# Altium project BEAGLEBONEBLACK.PrjPcb (part 1 of 6)
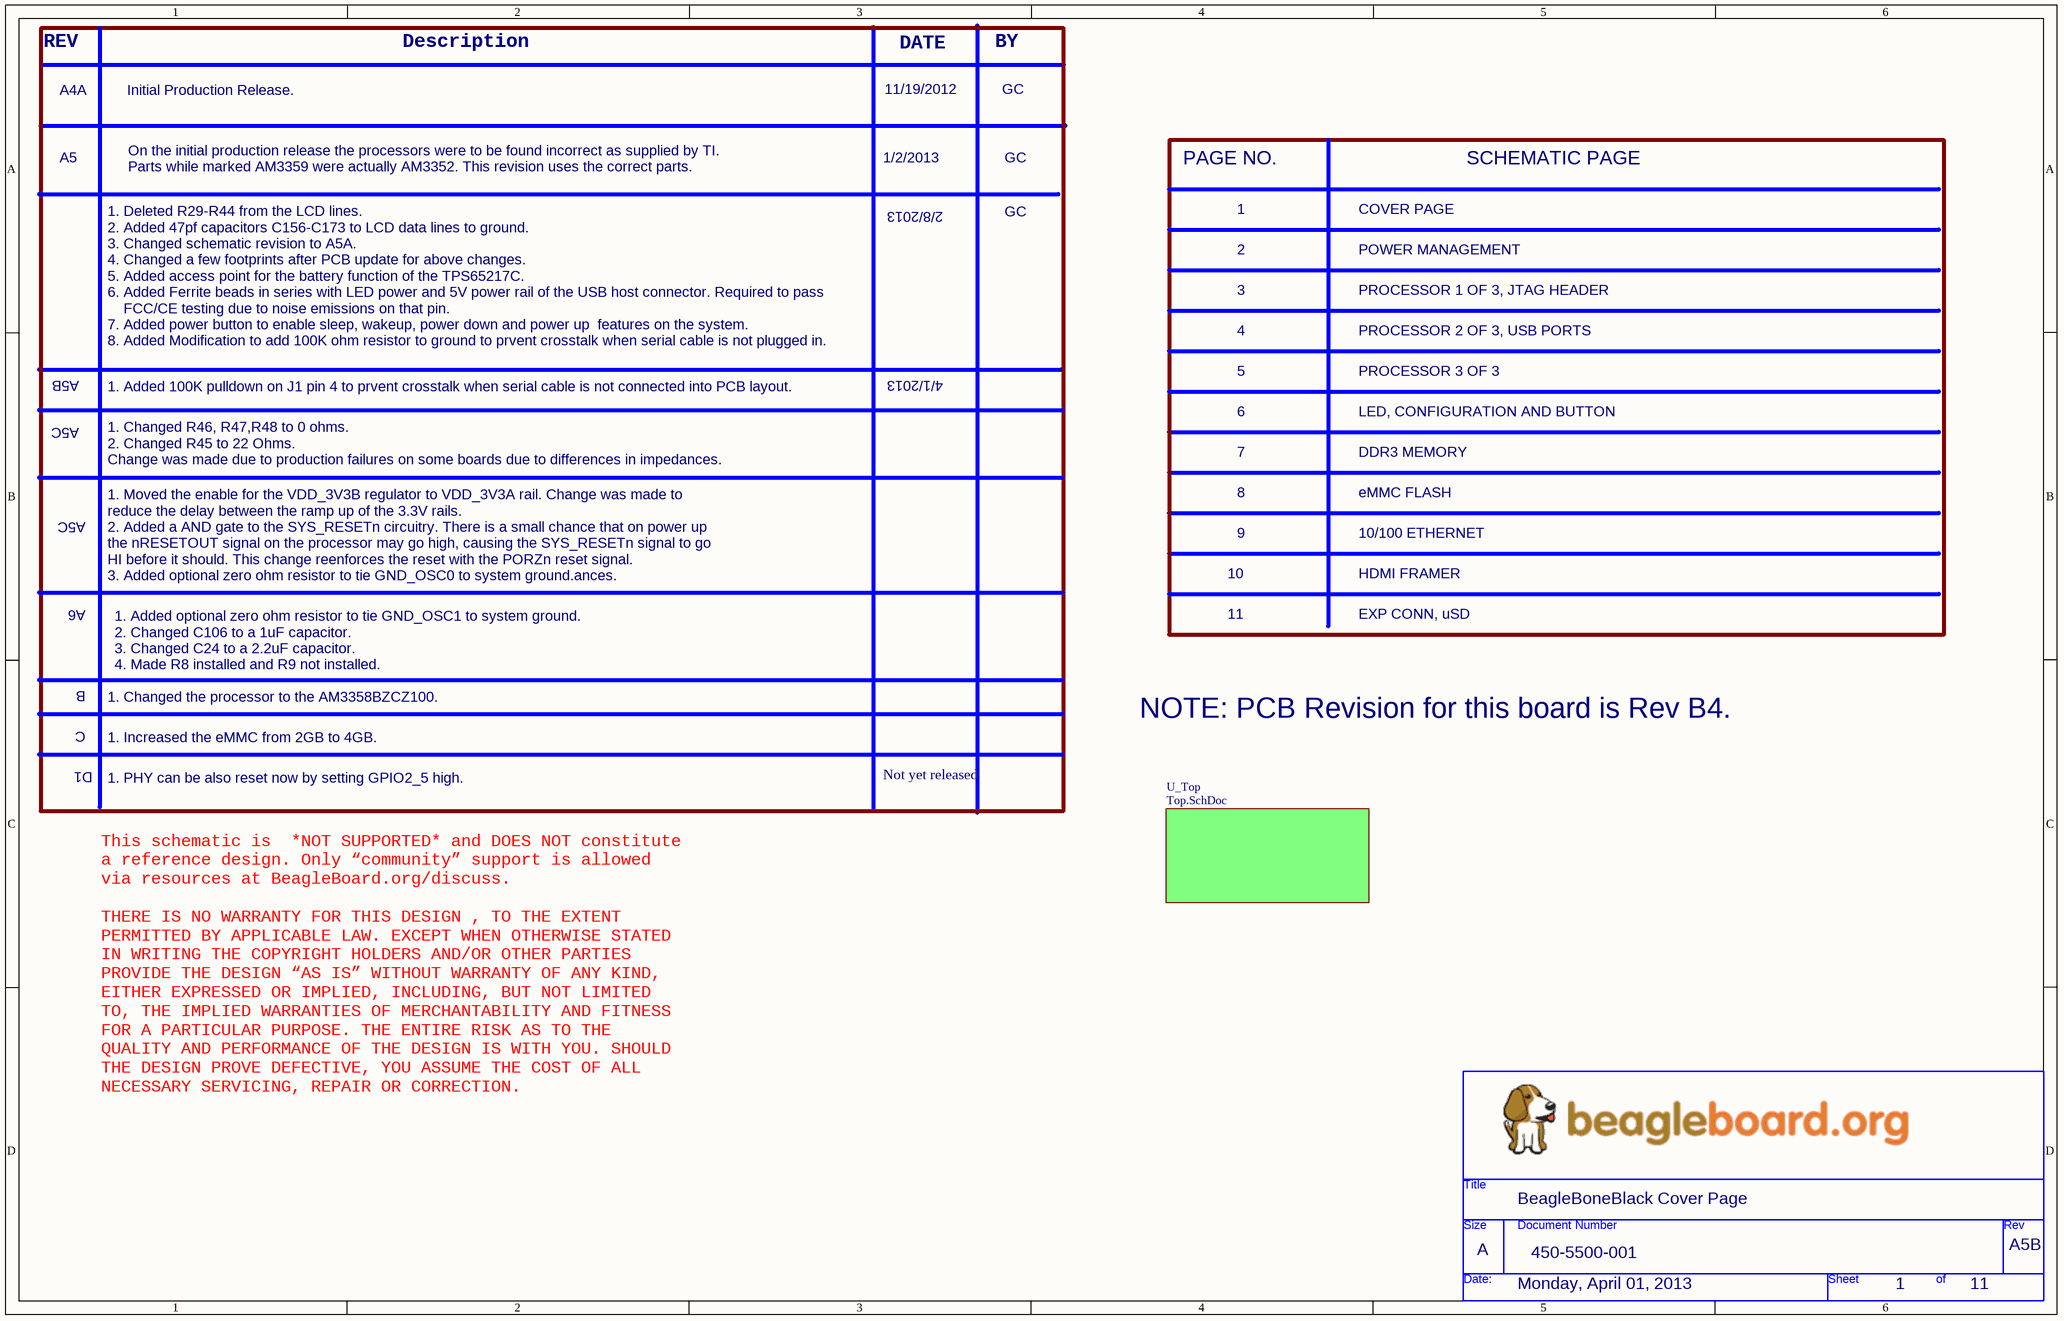
[diagram p0: P01_Title Page.SchDoc]
17 sheets, 400 parts. Net scope: flat (ports and power ports of the same name join across sheets).
Board file: BEAGLEBONE_BLACK.PCBDOC
Sheets:
  P01_Title Page.SchDoc
    U_Top = Top.SchDoc
      U_P02_Power Management = P02_Power Management.SchDoc
      U_P07_DDR3 Memory = P07_DDR3 Memory.SchDoc
      U_P10_HDMI Framer = P10_HDMI Framer.SchDoc
      U_P04_Processor 2 or 3, USB and Serial = P04_Processor 2 or 3, USB and Serial.SchDoc
      U_P03_Processor 1 of 3, JTAG Header = P03_Processor 1 of 3, JTAG Header.SchDoc
      U_P05_Processor Page 3 of 3 = P05_Processor Page 3 of 3.SchDoc
      U_P06_LED, Config, & Button = P06_LED, Config, & Button.SchDoc
      U_P08_eMMC = P08_eMMC.SchDoc
      U_P09_Ethernet = P09_Ethernet.SchDoc
      U_P11_Exp Conn, uSD, and = P11_Exp Conn, uSD, and .SchDoc
      Console.SchDoc = U_Console.SchDoc
      US_SDCARD = SDCARD.SchDoc
      U_BOARD_ID = BoardID.SchDoc
      U_USB_PC = USB_PC.SchDoc
      U_USB_HOST = USB_Host.SchDoc

## Sheet P01_Title Page.SchDoc
size 386 x 246 mm

### Parts
(Parts that share a designator on the sheet are numbered #1, #2 ... from top to bottom, then left to right.)
*#1  Page Create Date: Monday, April 01, 2013  Doc: 450-5500-001  RevCode: A5B  Title: BeagleBoneBlack Cover Page  Page Size: A  Page Number: 1  Page Count: 11  (hidden comment: BeagleBoard_org)  (graphical)

### Sub-sheets
U_Top = Top.SchDoc: no entries

### Notes on the sheet
- REV
- Description
- DATE
- BY
- A4A
- Initial Production Release.
- 11/19/2012
- GC
- A5
- On the initial production release the processors were to be found incorrect as supplied by TI.
  Parts while marked AM3359 were actually AM3352. This revision uses the correct parts.
- 1/2/2013
- PAGE NO.
- SCHEMATIC PAGE
- 2/8/2013
- 1
- 2
- POWER MANAGEMENT
- COVER PAGE
- 3
- PROCESSOR 1 OF 3, JTAG HEADER
- A5B
- 4/1/2013
- 4
- 5
- PROCESSOR 2 OF 3, USB PORTS
- PROCESSOR 3 OF 3
- A5C
- 1. Deleted R29-R44 from the LCD lines.
  2. Added 47pf capacitors C156-C173 to LCD data lines to ground.
  3. Changed schematic revision to A5A.
  4. Changed a few footprints after PCB update for above changes.
  5. Added access point for the battery function of the TPS65217C.
  6. Added Ferrite beads in series with LED power and 5V power rail of the USB host connector. Required to pass
  FCC/CE testing due to noise emissions on that pin.
  7. Added power button to enable sleep, wakeup, power down and power up  features on the system.
  8. Added Modification to add 100K ohm resistor to ground to prvent crosstalk when serial cable is not plugged in.
- 7
- 6
- DDR3 MEMORY
- LED, CONFIGURATION AND BUTTON
- 1. Added 100K pulldown on J1 pin 4 to prvent crosstalk when serial cable is not connected into PCB layout.
- 1. Changed R46, R47,R48 to 0 ohms.
  2. Changed R45 to 22 Ohms.
  Change was made due to production failures on some boards due to differences in impedances.
- 8
- eMMC FLASH
- 1. Moved the enable for the VDD_3V3B regulator to VDD_3V3A rail. Change was made to
  reduce the delay between the ramp up of the 3.3V rails.
  2. Added a AND gate to the SYS_RESETn circuitry. There is a small chance that on power up
  the nRESETOUT signal on the processor may go high, causing the SYS_RESETn signal to go
  HI before it should. This change reenforces the reset with the PORZn reset signal.
  3. Added optional zero ohm resistor to tie GND_OSC0 to system ground.ances.
- 10
- 9
- HDMI FRAMER
- 10/100 ETHERNET
- A6
- 11
- EXP CONN, uSD
- B
- C
- 1. Changed the processor to the AM3358BZCZ100.
- 1. Added optional zero ohm resistor to tie GND_OSC1 to system ground.
  2. Changed C106 to a 1uF capacitor.
  3. Changed C24 to a 2.2uF capacitor.
  4. Made R8 installed and R9 not installed.
- NOTE: PCB Revision for this board is Rev B4.
- D1
- 1. Increased the eMMC from 2GB to 4GB.
- 1. PHY can be also reset now by setting GPIO2_5 high.
- Not yet released
- This schematic is  *NOT SUPPORTED* and DOES NOT constitute
  a reference design. Only “community” support is allowed
  via resources at BeagleBoard.org/discuss.
  THERE IS NO WARRANTY FOR THIS DESIGN , TO THE EXTENT
  PERMITTED BY APPLICABLE LAW. EXCEPT WHEN OTHERWISE STATED
  IN WRITING THE COPYRIGHT HOLDERS AND/OR OTHER PARTIES
  PROVIDE THE DESIGN “AS IS” WITHOUT WARRANTY OF ANY KIND,
  EITHER EXPRESSED OR IMPLIED, INCLUDING, BUT NOT LIMITED
  TO, THE IMPLIED WARRANTIES OF MERCHANTABILITY AND FITNESS
  FOR A PARTICULAR PURPOSE. THE ENTIRE RISK AS TO THE
  QUALITY AND PERFORMANCE OF THE DESIGN IS WITH YOU. SHOULD
  THE DESIGN PROVE DEFECTIVE, YOU ASSUME THE COST OF ALL
  NECESSARY SERVICING, REPAIR OR CORRECTION.
- (in symbol BeagleBoard_org) Title; Size; Document Number; Rev; Date:; Sheet; of

## Sheet Top.SchDoc
size Tabloid
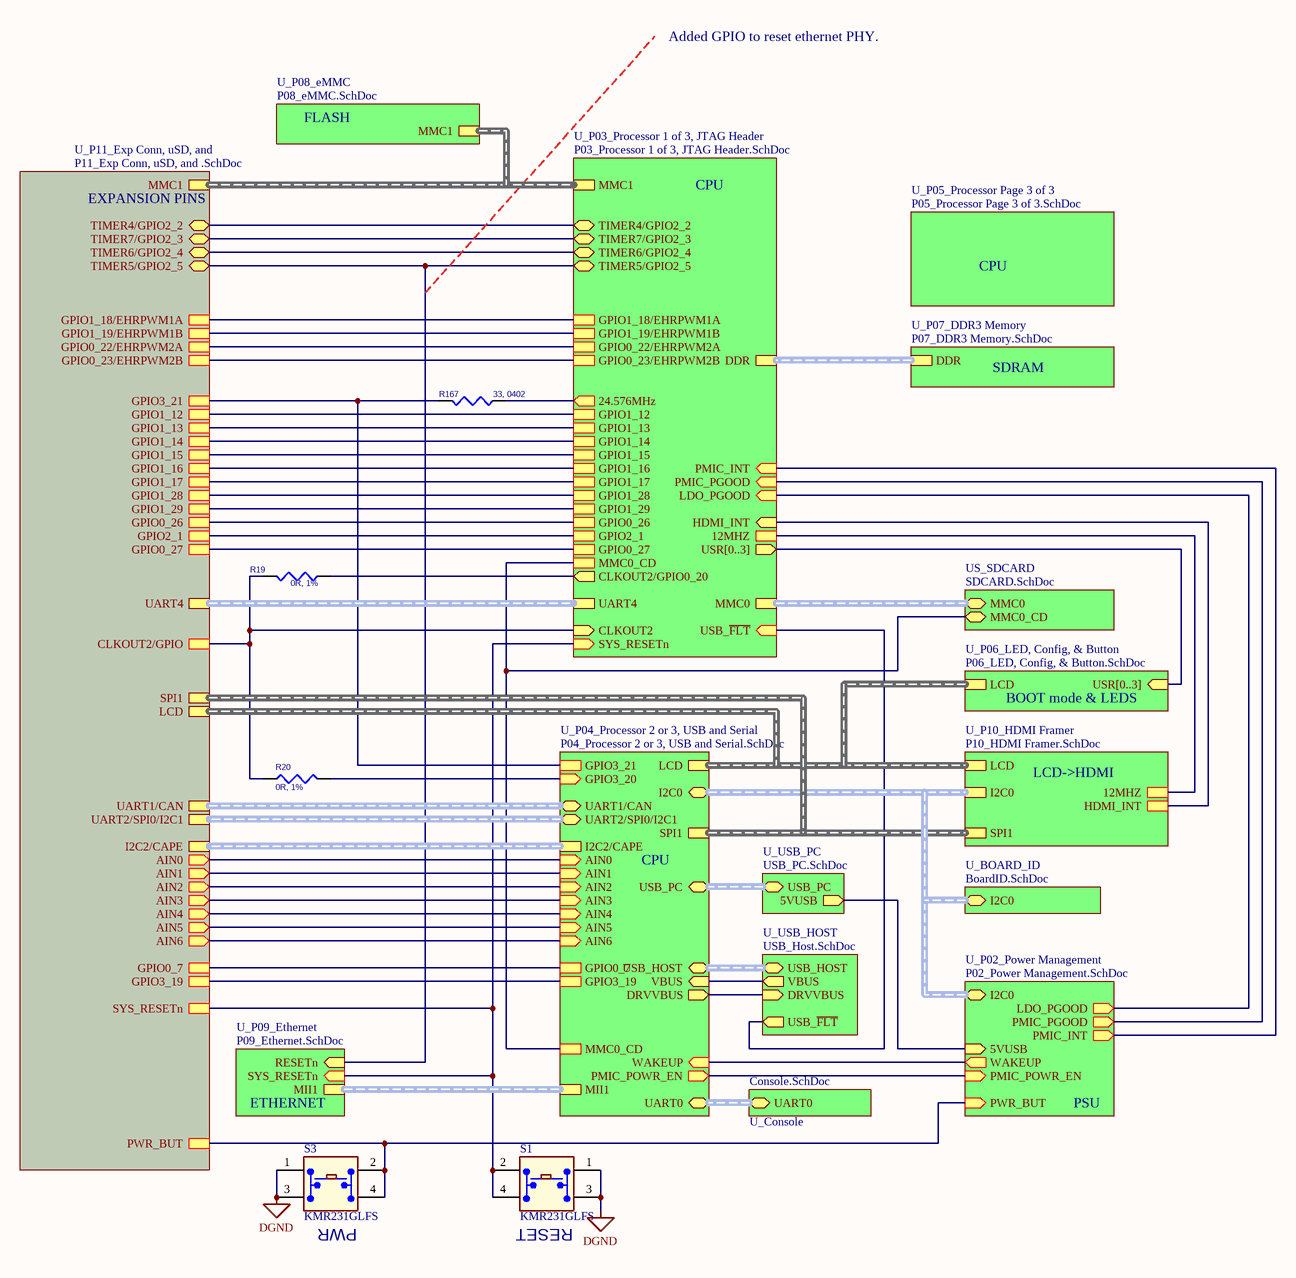
[diagram p1: Top.SchDoc]

### Parts
R19  0R, 1%  [402]
R20  0R, 1%  [402]
R167  33, 0402  [402]
S1  KMR231GLFS  [SW4SMD_63X161LS]
S3  KMR231GLFS  [SW4SMD_63X161LS]

### Sub-sheets
Console.SchDoc = U_Console: UART0 (harness UART)
U_BOARD_ID = BoardID.SchDoc: I2C0 (harness I2C)
U_P02_Power Management = P02_Power Management.SchDoc: PMIC_PGOOD (out), LDO_PGOOD (out), WAKEUP (out), PMIC_INT (out), PMIC_POWR_EN (in), PWR_BUT (in), I2C0 (harness I2C), 5VUSB (in)
U_P03_Processor 1 of 3, JTAG Header = P03_Processor 1 of 3, JTAG Header.SchDoc: GPIO2_1, GPIO1_29, GPIO1_28, GPIO0_22/EHRPWM2A, GPIO0_23/EHRPWM2B, GPIO0_26, GPIO0_27, GPIO1_12, GPIO1_13, GPIO1_14, GPIO1_15, GPIO1_17, GPIO1_18/EHRPWM1A, GPIO1_19/EHRPWM1B, USB_~{FLT} (in), SYS_RESETn (in), PMIC_INT (in), 12MHZ, GPIO1_16, 24.576MHz (out), LDO_PGOOD (in), PMIC_PGOOD (in), MMC0_CD, HDMI_INT (in), USR[0..3] (out), MMC1 (harness MMC1), MMC0 (harness MMC0), UART4 (harness UART), DDR (harness DDR), CLKOUT2/GPIO0_20 (out), CLKOUT2 (in), TIMER5/GPIO2_5 (bidir), TIMER4/GPIO2_2 (bidir), TIMER7/GPIO2_3 (bidir), TIMER6/GPIO2_4 (bidir)
U_P04_Processor 2 or 3, USB and Serial = P04_Processor 2 or 3, USB and Serial.SchDoc: GPIO3_21, GPIO3_19, GPIO3_20 (in), PMIC_POWR_EN (out), WAKEUP (in), AIN0 (in), AIN1 (in), AIN2 (in), AIN3 (in), AIN4 (in), AIN5 (in), AIN6 (in), MMC0_CD, GPIO0_7, LCD (harness LCD), SPI1 (harness SPI), I2C2/CAPE (harness I2C), MII1 (harness MII), I2C0 (harness I2C), UART0 (harness UART), UART1/CAN (harness UART/CAN), UART2/SPI0/I2C1 (harness UART/SPI/I2C1), USB_PC (harness USB_PC), USB_HOST (harness USB_PC), VBUS (in), DRVVBUS (out)
U_P05_Processor Page 3 of 3 = P05_Processor Page 3 of 3.SchDoc: no entries
U_P06_LED, Config, & Button = P06_LED, Config, & Button.SchDoc: USR[0..3] (in), LCD (harness LCD)
U_P07_DDR3 Memory = P07_DDR3 Memory.SchDoc: DDR (harness DDR)
U_P08_eMMC = P08_eMMC.SchDoc: MMC1 (harness MMC1)
U_P09_Ethernet = P09_Ethernet.SchDoc: MII1 (harness MII), RESETn (in), SYS_RESETn (in)
U_P10_HDMI Framer = P10_HDMI Framer.SchDoc: HDMI_INT, 12MHZ, I2C0 (harness I2C), LCD (harness LCD), SPI1 (harness SPI)
U_P11_Exp Conn, uSD, and = P11_Exp Conn, uSD, and .SchDoc: GPIO1_13, GPIO0_23/EHRPWM2B, GPIO1_15, GPIO0_27, GPIO0_22/EHRPWM2A, GPIO1_12, GPIO0_26, GPIO1_14, GPIO2_1, GPIO1_29, PWR_BUT, GPIO1_16, GPIO1_17, GPIO3_21, GPIO3_19, AIN4 (out), AIN6 (out), AIN2 (out), AIN0 (out), CLKOUT2/GPIO, SYS_RESETn, GPIO1_28, GPIO1_18/EHRPWM1A, GPIO1_19/EHRPWM1B, AIN5 (out), AIN3 (out), AIN1 (out), GPIO0_7, LCD (harness LCD), MMC1 (harness MMC1), UART4 (harness UART), I2C2/CAPE (harness I2C), UART2/SPI0/I2C1 (harness UART/SPI/I2C1), UART1/CAN (harness UART/CAN), SPI1 (harness SPI), TIMER5/GPIO2_5 (bidir), TIMER7/GPIO2_3 (bidir), TIMER6/GPIO2_4 (bidir), TIMER4/GPIO2_2 (bidir)
U_USB_HOST = USB_Host.SchDoc: USB_HOST (harness USB_PC), USB_~{FLT} (out), VBUS (out), DRVVBUS (in)
U_USB_PC = USB_PC.SchDoc: USB_PC (harness USB_PC), 5VUSB (out)
US_SDCARD = SDCARD.SchDoc: MMC0 (harness MMC0), MMC0_CD

### Nets
DGND: S1.1(A1) S1.3(A3) S3.1(A1) S3.3(A3)
NetR19_1: R19.1 ; sheet U_P03_Processor 1 of 3, JTAG Header/CLKOUT2/GPIO0_20
NetR19_2: R19.2 R20.1 ; sheet U_P03_Processor 1 of 3, JTAG Header/CLKOUT2, sheet U_P11_Exp Conn, uSD, and/CLKOUT2/GPIO
NetR20_2: R20.2 ; sheet U_P04_Processor 2 or 3, USB and Serial/GPIO3_20
NetR167_1: R167.1 ; sheet U_P03_Processor 1 of 3, JTAG Header/24.576MHz
NetR167_2: R167.2 ; sheet U_P04_Processor 2 or 3, USB and Serial/GPIO3_21, sheet U_P11_Exp Conn, uSD, and/GPIO3_21
NetS1_2: S1.2(A2) S1.4 ; sheet U_P03_Processor 1 of 3, JTAG Header/SYS_RESETn, sheet U_P09_Ethernet/SYS_RESETn, sheet U_P11_Exp Conn, uSD, and/SYS_RESETn
NetS3_2: S3.2(A2) S3.4 ; sheet U_P02_Power Management/PWR_BUT, sheet U_P11_Exp Conn, uSD, and/PWR_BUT
(unnamed): sheet U_P02_Power Management/PMIC_PGOOD, sheet U_P03_Processor 1 of 3, JTAG Header/PMIC_PGOOD
(unnamed): sheet U_P02_Power Management/LDO_PGOOD, sheet U_P03_Processor 1 of 3, JTAG Header/LDO_PGOOD
(unnamed): sheet U_P02_Power Management/WAKEUP, sheet U_P04_Processor 2 or 3, USB and Serial/WAKEUP
(unnamed): sheet U_P02_Power Management/PMIC_INT, sheet U_P03_Processor 1 of 3, JTAG Header/PMIC_INT
(unnamed): sheet U_P02_Power Management/PMIC_POWR_EN, sheet U_P04_Processor 2 or 3, USB and Serial/PMIC_POWR_EN
(unnamed): sheet U_P02_Power Management/5VUSB, sheet U_USB_PC/5VUSB
(unnamed): sheet U_P10_HDMI Framer/HDMI_INT, sheet U_P03_Processor 1 of 3, JTAG Header/HDMI_INT
(unnamed): sheet U_P10_HDMI Framer/12MHZ, sheet U_P03_Processor 1 of 3, JTAG Header/12MHZ
(unnamed): sheet U_P04_Processor 2 or 3, USB and Serial/GPIO3_19, sheet U_P11_Exp Conn, uSD, and/GPIO3_19
(unnamed): sheet U_P04_Processor 2 or 3, USB and Serial/AIN0, sheet U_P11_Exp Conn, uSD, and/AIN0
(unnamed): sheet U_P04_Processor 2 or 3, USB and Serial/AIN1, sheet U_P11_Exp Conn, uSD, and/AIN1
(unnamed): sheet U_P04_Processor 2 or 3, USB and Serial/AIN2, sheet U_P11_Exp Conn, uSD, and/AIN2
(unnamed): sheet U_P04_Processor 2 or 3, USB and Serial/AIN3, sheet U_P11_Exp Conn, uSD, and/AIN3
(unnamed): sheet U_P04_Processor 2 or 3, USB and Serial/AIN4, sheet U_P11_Exp Conn, uSD, and/AIN4
(unnamed): sheet U_P04_Processor 2 or 3, USB and Serial/AIN5, sheet U_P11_Exp Conn, uSD, and/AIN5
(unnamed): sheet U_P04_Processor 2 or 3, USB and Serial/AIN6, sheet U_P11_Exp Conn, uSD, and/AIN6
(unnamed): sheet U_P04_Processor 2 or 3, USB and Serial/MMC0_CD, sheet U_P03_Processor 1 of 3, JTAG Header/MMC0_CD, sheet US_SDCARD/MMC0_CD
(unnamed): sheet U_P04_Processor 2 or 3, USB and Serial/GPIO0_7, sheet U_P11_Exp Conn, uSD, and/GPIO0_7
(unnamed): sheet U_P04_Processor 2 or 3, USB and Serial/VBUS, sheet U_USB_HOST/VBUS
(unnamed): sheet U_P04_Processor 2 or 3, USB and Serial/DRVVBUS, sheet U_USB_HOST/DRVVBUS
(unnamed): sheet U_P03_Processor 1 of 3, JTAG Header/GPIO2_1, sheet U_P11_Exp Conn, uSD, and/GPIO2_1
(unnamed): sheet U_P03_Processor 1 of 3, JTAG Header/GPIO1_29, sheet U_P11_Exp Conn, uSD, and/GPIO1_29
(unnamed): sheet U_P03_Processor 1 of 3, JTAG Header/GPIO1_28, sheet U_P11_Exp Conn, uSD, and/GPIO1_28
(unnamed): sheet U_P03_Processor 1 of 3, JTAG Header/GPIO0_22/EHRPWM2A, sheet U_P11_Exp Conn, uSD, and/GPIO0_22/EHRPWM2A
(unnamed): sheet U_P03_Processor 1 of 3, JTAG Header/GPIO0_23/EHRPWM2B, sheet U_P11_Exp Conn, uSD, and/GPIO0_23/EHRPWM2B
(unnamed): sheet U_P03_Processor 1 of 3, JTAG Header/GPIO0_26, sheet U_P11_Exp Conn, uSD, and/GPIO0_26
(unnamed): sheet U_P03_Processor 1 of 3, JTAG Header/GPIO0_27, sheet U_P11_Exp Conn, uSD, and/GPIO0_27
(unnamed): sheet U_P03_Processor 1 of 3, JTAG Header/GPIO1_12, sheet U_P11_Exp Conn, uSD, and/GPIO1_12
(unnamed): sheet U_P03_Processor 1 of 3, JTAG Header/GPIO1_13, sheet U_P11_Exp Conn, uSD, and/GPIO1_13
(unnamed): sheet U_P03_Processor 1 of 3, JTAG Header/GPIO1_14, sheet U_P11_Exp Conn, uSD, and/GPIO1_14
(unnamed): sheet U_P03_Processor 1 of 3, JTAG Header/GPIO1_15, sheet U_P11_Exp Conn, uSD, and/GPIO1_15
(unnamed): sheet U_P03_Processor 1 of 3, JTAG Header/GPIO1_17, sheet U_P11_Exp Conn, uSD, and/GPIO1_17
(unnamed): sheet U_P03_Processor 1 of 3, JTAG Header/GPIO1_18/EHRPWM1A, sheet U_P11_Exp Conn, uSD, and/GPIO1_18/EHRPWM1A
(unnamed): sheet U_P03_Processor 1 of 3, JTAG Header/GPIO1_19/EHRPWM1B, sheet U_P11_Exp Conn, uSD, and/GPIO1_19/EHRPWM1B
(unnamed): sheet U_P03_Processor 1 of 3, JTAG Header/USB_~{FLT}, sheet U_USB_HOST/USB_~{FLT}
(unnamed): sheet U_P03_Processor 1 of 3, JTAG Header/GPIO1_16, sheet U_P11_Exp Conn, uSD, and/GPIO1_16
(unnamed): sheet U_P03_Processor 1 of 3, JTAG Header/TIMER5/GPIO2_5, sheet U_P09_Ethernet/RESETn, sheet U_P11_Exp Conn, uSD, and/TIMER5/GPIO2_5
(unnamed): sheet U_P03_Processor 1 of 3, JTAG Header/TIMER4/GPIO2_2, sheet U_P11_Exp Conn, uSD, and/TIMER4/GPIO2_2
(unnamed): sheet U_P03_Processor 1 of 3, JTAG Header/TIMER7/GPIO2_3, sheet U_P11_Exp Conn, uSD, and/TIMER7/GPIO2_3
(unnamed): sheet U_P03_Processor 1 of 3, JTAG Header/TIMER6/GPIO2_4, sheet U_P11_Exp Conn, uSD, and/TIMER6/GPIO2_4

### Buses and harness runs
bus sheet U_P03_Processor 1 of 3, JTAG Header/USR[0..3] = sheet U_P06_LED, Config, & Button/USR[0..3]
harness sheet Console.SchDoc/UART0 = sheet U_P04_Processor 2 or 3, USB and Serial/UART0
harness sheet U_BOARD_ID/I2C0 = sheet U_P02_Power Management/I2C0 = sheet U_P04_Processor 2 or 3, USB and Serial/I2C0 = sheet U_P10_HDMI Framer/I2C0
harness sheet U_P03_Processor 1 of 3, JTAG Header/DDR = sheet U_P07_DDR3 Memory/DDR
harness sheet U_P03_Processor 1 of 3, JTAG Header/MMC0 = sheet US_SDCARD/MMC0
harness sheet U_P03_Processor 1 of 3, JTAG Header/MMC1 = sheet U_P08_eMMC/MMC1 = sheet U_P11_Exp Conn, uSD, and/MMC1
harness sheet U_P03_Processor 1 of 3, JTAG Header/UART4 = sheet U_P11_Exp Conn, uSD, and/UART4
harness sheet U_P04_Processor 2 or 3, USB and Serial/I2C2/CAPE = sheet U_P11_Exp Conn, uSD, and/I2C2/CAPE
harness sheet U_P04_Processor 2 or 3, USB and Serial/LCD = sheet U_P06_LED, Config, & Button/LCD = sheet U_P10_HDMI Framer/LCD = sheet U_P11_Exp Conn, uSD, and/LCD
harness sheet U_P04_Processor 2 or 3, USB and Serial/MII1 = sheet U_P09_Ethernet/MII1
harness sheet U_P04_Processor 2 or 3, USB and Serial/SPI1 = sheet U_P10_HDMI Framer/SPI1 = sheet U_P11_Exp Conn, uSD, and/SPI1
harness sheet U_P04_Processor 2 or 3, USB and Serial/UART1/CAN = sheet U_P11_Exp Conn, uSD, and/UART1/CAN
harness sheet U_P04_Processor 2 or 3, USB and Serial/UART2/SPI0/I2C1 = sheet U_P11_Exp Conn, uSD, and/UART2/SPI0/I2C1
harness sheet U_P04_Processor 2 or 3, USB and Serial/USB_HOST = sheet U_USB_HOST/USB_HOST
harness sheet U_P04_Processor 2 or 3, USB and Serial/USB_PC = sheet U_USB_PC/USB_PC

### Notes on the sheet
- Added GPIO to reset ethernet PHY.
- FLASH
- EXPANSION PINS
- CPU
- SDRAM
- BOOT mode & LEDS
- LCD->HDMI
- ETHERNET
- PSU
- (near S3) PWR
- (near S1) RESET

### Library data of the parts
R19 R20 = RES_0_1/16W_1%_0402: RES 0.0 OHM 1/16W 0402 SMD; Manufacturer: Yageo; Manufacturer Part Number: RC0402JR-070RL; Resistance (Ohms): 0.0; Power (Watts): 0.063W, 1/16W; Tolerance: Jumper; Supplier 1: Digi-Key; Supplier Part Number 1: 311-0.0JRDKR-ND; RoHS: RoHS Compliant; Category: Resistors; Stock 1: 4904429; Pricing 1: 1=0.1, 10=0.012, 25=0.0092, 100=0.0055, 250=0.00476, 500=0.00336, 1000=0.00237, 2500=0.00206, 5000=0.00178 (USD); Composition: Thick Film; Features: -; Temperature Coefficient: -; Package / Case: 0402 (1005 Metric); Supplier Device Package: 0402; Size / Dimension: 0.039" L x 0.020" W (1.00mm x 0.50mm); Height: 0.016" (0.40mm); Number of Terminations: 2; Packaging: Digi-Reel®; ComponentLink1URL: http://www.yageo.com/documents/recent/PYu-RC0402_51_RoHS_L_6.pdf; ComponentLink1Description: http://www.yageo.com/documents/recent/PYu-RC0402_51_RoHS_L_6.pdf
R167 = RES_33_0402: RES 33 OHM 1/16W 5% 0402 SMD; Manufacturer: Panasonic Electronic Components; Manufacturer Part Number: ERJ-2GEJ330X; Resistance (Ohms): 33; Power (Watts): 0.1W, 1/10W; Temperature Coefficient: ±200ppm/°C; Supplier 1: Digi-Key; Supplier Part Number 1: P33JDKR-ND; RoHS: RoHS Compliant; Category: Resistors; Stock 1: 5879945; Pricing 1: 1=0.1, 50=0.0172, 100=0.0131, 250=0.00976, 500=0.0072, 1000=0.0048, 5000=0.00338 (USD); Composition: Thick Film; Features: -; Tolerance: ±5%; Package / Case: 0402 (1005 Metric); Supplier Device Package: 0402; Size / Dimension: 0.039" L x 0.020" W (1.00mm x 0.50mm); Height: 0.016" (0.40mm); Number of Terminations: 2; Packaging: Digi-Reel®; ComponentLink1URL: http://industrial.panasonic.com/www-cgi/jvcr13pz.cgi?E+PZ+3+AOA0001+ERJ2GEJ330X+7+WW; ComponentLink1Description: http://industrial.panasonic.com/www-cgi/jvcr13pz.cgi?E+PZ+3+AOA0001+ERJ2GEJ330X+7+WW
S1 S3 = KMR2: Microminiature Tact Switch for SMT; Manufacturer: C&K Components; Circuit: SPST-NO; Switch Function: Off-Mom; Contact Rating @ Voltage: 0.05A @ 32VDC; Actuator Type: Standard; Actuator Height off PCB, from Pins: 1.90mm; Actuator Orientation: Top Actuated; Outline: 4.60mm x 2.80mm; Illumination: Non-Illuminated; Operating Force: 300gf; Switch Travel: 0.25mm; Mechanical Life: 150,000 Cycles; Supplier 1: Digi-Key; Supplier Part Number 1: 401-1429-6-ND; Manufacturer Part Number: KMR231GLFS; RoHS: RoHS Compliant; Category: Switches; Stock 1: 32289; Pricing 1: 1=0.44, 10=0.416, 25=0.3744, 50=0.3326, 100=0.3188, 250=0.29108, 500=0.2772, 1000=0.22869 (USD); Mounting Type: Surface Mount; Termination Style: Gull Wing; Illumination Voltage (Nominal): -; Illumination Type, Color: -; Ingress Protection: -; Features: Grounding Pin; Packaging: Digi-Reel®; Actuator Material: -; Operating Temperature: -40°C ~ 85°C; ComponentLink1URL: http://www.ck-components.com/index.php?module=media&action=Display&cmpref=14414&lang=en&width=&height=&format=&alt=; ComponentLink1Description: http://www.ck-components.com/index.php?module=media&action=Display&cmpref=14414&lang=en&width=&height=&format=&alt=

## Sheet P02_Power Management.SchDoc
size 386 x 246 mm
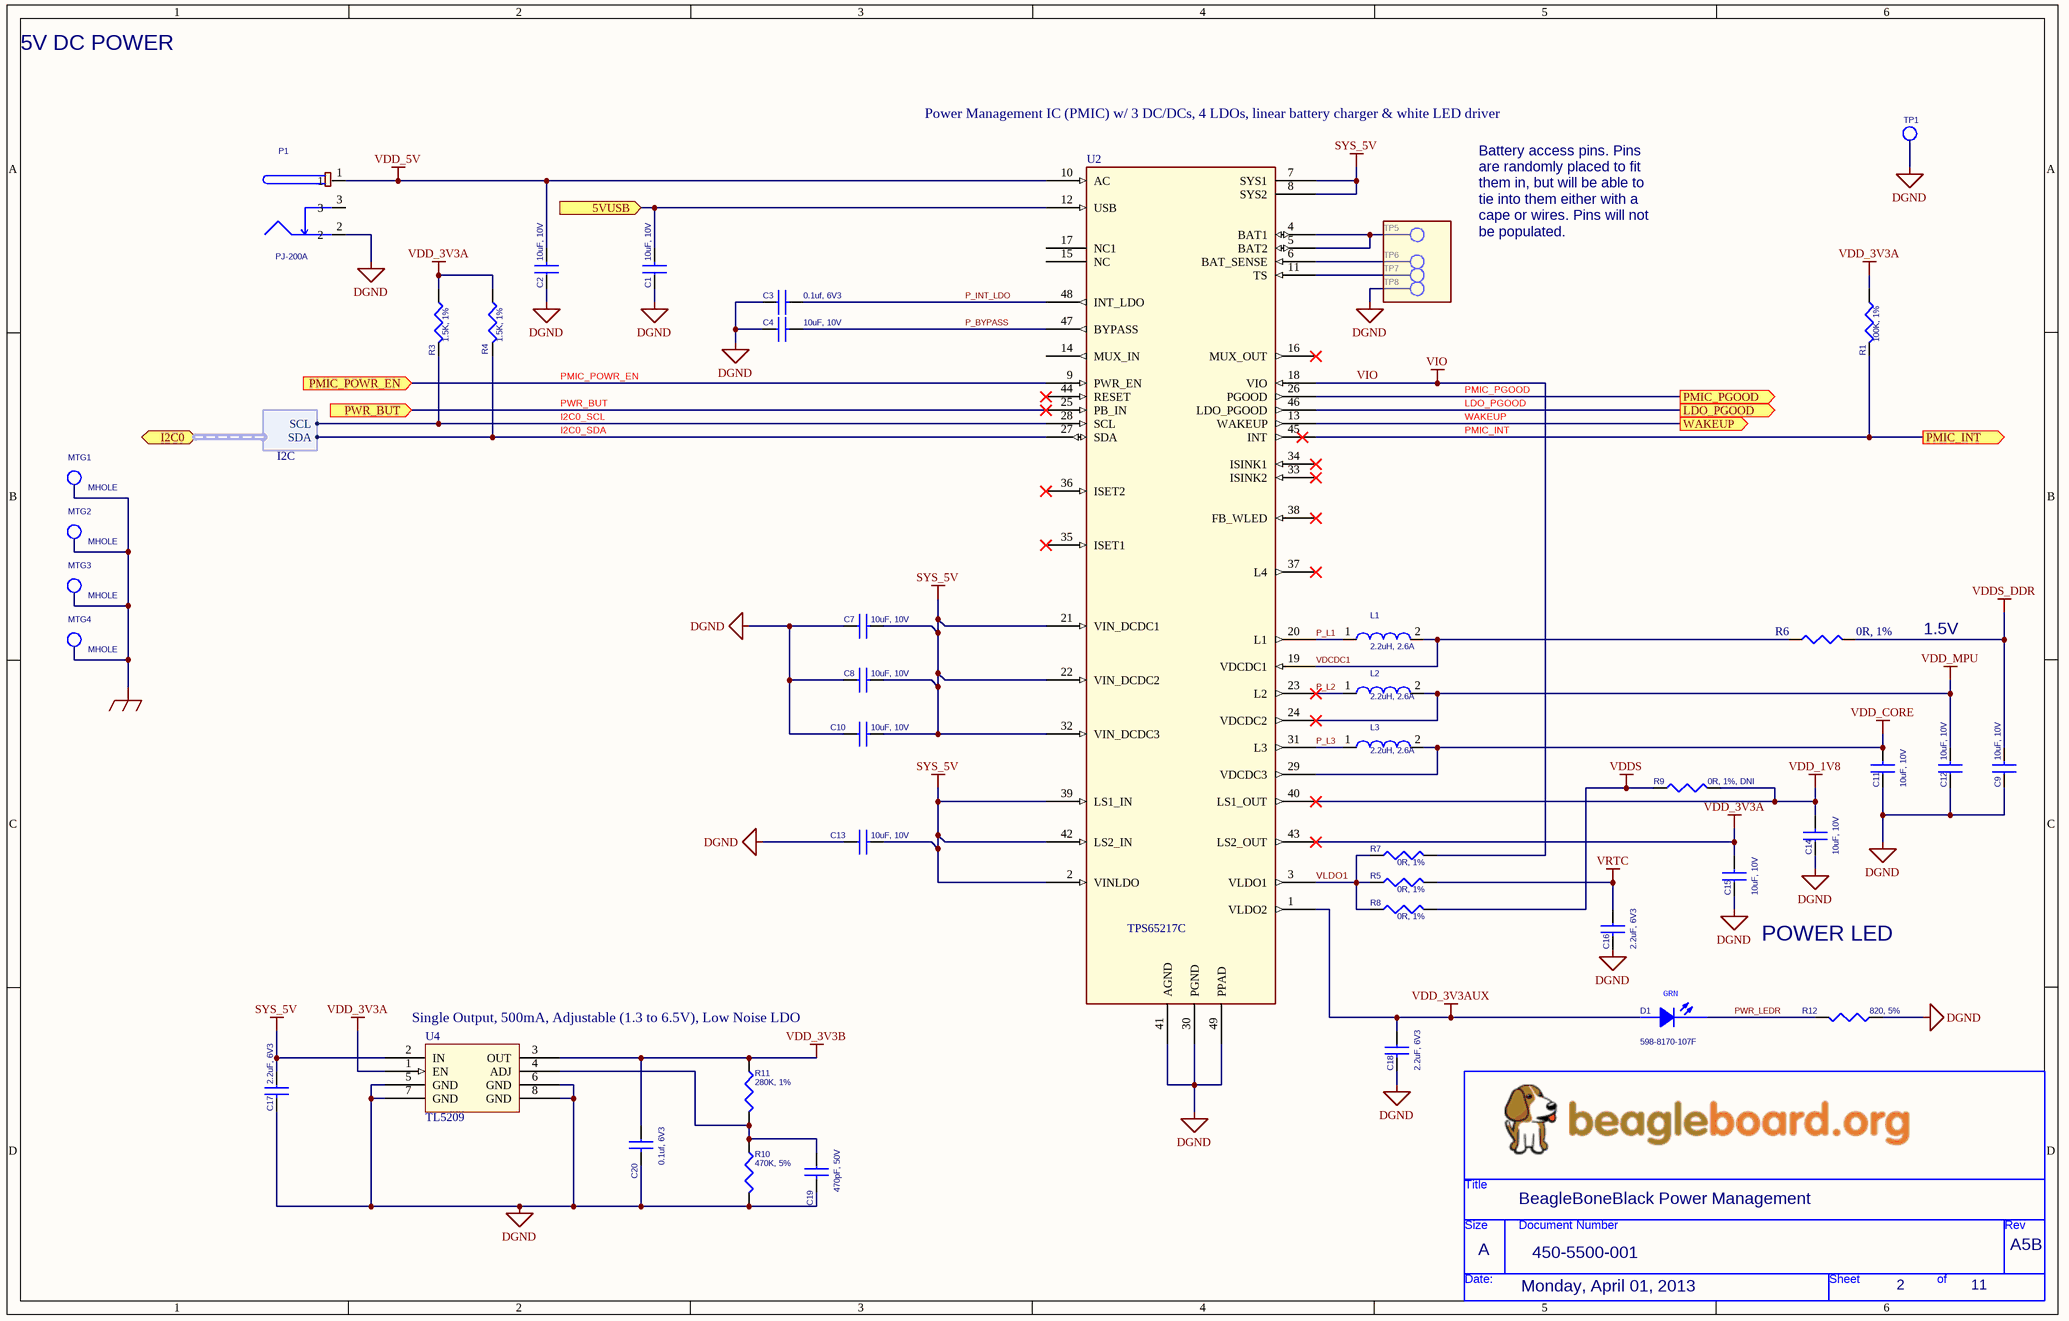
[diagram p2: P02_Power Management.SchDoc]

### Parts
(Parts that share a designator on the sheet are numbered #1, #2 ... from top to bottom, then left to right.)
*#2  Page Create Date: Monday, April 01, 2013  Doc: 450-5500-001  RevCode: A5B  Title: BeagleBoneBlack Power Management  Page Size: A  Page Number: 2  Page Count: 11  (hidden comment: BeagleBoard_org)  (graphical)
C1  10uF, 10V  [805]
C2  10uF, 10V  [805]
C3  0.1uf, 6V3  [402]
C4  10uF, 10V  [805]
C7  10uF, 10V  [805]
C8  10uF, 10V  [805]
C9  10uF, 10V  [805]
C10  10uF, 10V  [805]
C11  10uF, 10V  [805]
C12  10uF, 10V  [805]
C13  10uF, 10V  [805]
C14  10uF, 10V  [805]
C15  10uF, 10V  [805]
C16  2.2uF, 6V3  [402]
C17  2.2uF, 6V3  [402]
C18  2.2uF, 6V3  [402]
C19  470pF, 50V  [402]
C20  0.1uf, 6V3  [402]
D1  598-8170-107F  [LED_0603]
L1  2.2uH, 2.6A  [2520]
L2  2.2uH, 2.6A  [2520]
L3  2.2uH, 2.6A  [2520]
MTG1  MHOLE  [MTGH200C125D_PL]  (no BOM)
MTG2  MHOLE  [MTGH200C125D_PL]  (no BOM)
MTG3  MHOLE  [MTGH200C125D_PL]  (no BOM)
MTG4  MHOLE  [MTGH200C125D_PL]  (no BOM)
P1  PJ-200A  [CONN3-PWR-PJ102A]
R1  100K, 1%  [402]
R3  1.5K, 1%  [402]
R4  1.5K, 1%  [402]
R5  0R, 1%  [402]
R6  0R, 1%  [402]
R7  0R, 1%  [402]
R8  0R, 1%  [402]
R9  0R, 1%, DNI  [402]
R10  470K, 5%  [402]
R11  280K, 1%  [402]
R12  820, 5%  [402]
TP1  TESTPT1  [tp1-8040]  (value not drawn)  (no BOM)
TP5  TESTPT1  [TP60C33D]  (value not drawn)  (no BOM)
TP6  TESTPT1  [TP60C33D]  (value not drawn)  (no BOM)
TP7  TESTPT1  [TP60C33D]  (value not drawn)  (no BOM)
TP8  TESTPT1  [TP60C33D]  (value not drawn)  (no BOM)
U2  TPS65217C  [U_48_RSL]
U4  TL5209  [SO8-25X75]

### Ports
5VUSB (in), I2C0 (harness I2C), LDO_PGOOD (out), PMIC_INT (out), PMIC_PGOOD (out), PMIC_POWR_EN (in), PWR_BUT (in), WAKEUP (out)

### Harnesses
I2C: SCL, SDA

### Nets
DGND: C1.1 C2.1 C3.1 C4.1 C7.1 C8.1 C9.1 C10.1 C11.1 C12.1 C13.1 C14.1 C15.1 C16.2 C17.2 C18.2 C19.2 C20.2 P1.2 R10.2 R12.1 TP1.1(TP) TP8.1(TP) U2.30(PGND) U2.41(AGND) U2.49(PPAD) U4.5(GND) U4.6(GND) U4.7(GND) U4.8(GND)
GND_EARTH: MTG1.1(TP) MTG2.1(TP) MTG3.1(TP) MTG4.1(TP)
SYS_5V: C7.2 C8.2 C10.2 C13.2 C17.1 U2.2(VINLDO) U2.7(SYS1) U2.8(SYS2) U2.21(VIN_DCDC1) U2.22(VIN_DCDC2) U2.32(VIN_DCDC3) U2.39(LS1_IN) U2.42(LS2_IN) U4.2(IN)
VDD_1V8: C14.2 R9.2 U2.40(LS1_OUT)
VDD_3V3A: C15.2 R1.1 R3.1 R4.1 U2.43(LS2_OUT) U4.1(EN)
VDD_3V3AUX: C18.1 D1.2(A) U2.1(VLDO2)
VDD_3V3B: C20.1 R11.1 U4.3(OUT)
VDD_5V: C2.2 P1.1 U2.10(AC)
VDD_CORE: C11.2 L3.2 U2.29(VDCDC3)
VDD_MPU: C12.2 L2.2 U2.24(VDCDC2)
VDDS: R8.2 R9.1
VDDS_DDR: C9.2 R6.2
VIO: R7.2 U2.18(VIO)
VRTC: C16.1 R5.2
I2C0_SCL: R3.2 U2.28(SCL) ; port I2C0.SCL
I2C0_SDA: R4.2 U2.27(SDA) ; port I2C0.SDA
LDO_PGOOD: U2.46(LDO_PGOOD) ; port LDO_PGOOD
P_BYPASS: C4.2 U2.47(BYPASS)
P_INT_LDO: C3.2 U2.48(INT_LDO)
P_L1: L1.1 U2.20(L1)
P_L2: L2.1 U2.23(L2)
P_L3: L3.1 U2.31(L3)
PMIC_INT: R1.2 U2.45(INT) ; port PMIC_INT
PMIC_PGOOD: U2.26(PGOOD) ; port PMIC_PGOOD
PMIC_POWR_EN: U2.9(PWR_EN) ; port PMIC_POWR_EN
PWR_BUT: U2.25(PB_IN) ; port PWR_BUT
PWR_LEDR: D1.1(C) R12.2
VDCDC1: L1.2 R6.1 U2.19(VDCDC1)
VLDO1: R5.1 R7.1 R8.1 U2.3(VLDO1)
WAKEUP: U2.13(WAKEUP) ; port WAKEUP
NetC1_2: C1.2 U2.12(USB) ; port 5VUSB
NetC19_1: C19.1 R10.1 R11.2 U4.4(ADJ)
NetTP5_1: TP5.1(TP) U2.4(BAT1) U2.5(BAT2)
NetTP6_1: TP6.1(TP) U2.6(BAT_SENSE)
NetTP7_1: TP7.1(TP) U2.11(TS)

Not connected (* = marked no-connect by the designer): P1 3; U2 14(MUX_IN) 15(NC) 16(MUX_OUT)* 17(NC1) 33(ISINK2)* 34(ISINK1)* 35(ISET1)* 36(ISET2)* 37(L4)* 38(FB_WLED)* 44(RESET)*

### Notes on the sheet
- 5V DC POWER
- Power Management IC (PMIC) w/ 3 DC/DCs, 4 LDOs, linear battery charger & white LED driver
- Battery access pins. Pins are randomly placed to fit them in, but will be able to tie into them either with a cape or wires. Pins will not be populated.
- 1.5V
- POWER LED
- Single Output, 500mA, Adjustable (1.3 to 6.5V), Low Noise LDO
- (in symbol BeagleBoard_org) Title; Size; Document Number; Rev; Date:; Sheet; of
- (in symbol LED_LTST-C150GKT) GRN

### Library data of the parts
C1 C2 = CAP_4.7uF_X5R_6.3V_10%_0603: CAP CER 10UF 10V Y5V 0805; Manufacturer: TDK Corporation; Manufacturer Part Number: C2012Y5V1A106Z; Capacitance: 10µF; Tolerance: -20%, +80%; Temperature Coefficient: Y5V (F); Supplier 1: Digi-Key; Supplier Part Number 1: 445-1371-6-ND; RoHS: RoHS Compliant; Category: Capacitors; Stock 1: 103255; Pricing 1: 1=0.15, 10=0.105, 100=0.0499, 250=0.042, 500=0.03518, 1000=0.02887 (USD); Voltage - Rated: 10V; Mounting Type: Surface Mount, MLCC; Operating Temperature: -30°C ~ 85°C; Applications: General Purpose; Ratings: -; Package / Case: 0805 (2012 Metric); Size / Dimension: 0.079" L x 0.049" W (2.00mm x 1.25mm); Height - Seated (Max): -; Thickness (Max): 0.057" (1.45mm); Lead Spacing: -; Features: -; Packaging: Digi-Reel®; Lead Style: -; ComponentLink1URL: http://media.digikey.com/pdf/Data%20Sheets/TDK%20PDFs/C_Series_GeneralAppl_B11.pdf; ComponentLink1Description: http://media.digikey.com/pdf/Data%20Sheets/TDK%20PDFs/C_Series_GeneralAppl_B11.pdf
C3 = CAP_10uF_Y5V_10V_10%_0805: CAP CER 0.1UF 6.3V 10% X5R 0402; Manufacturer: TDK Corporation; Manufacturer Part Number: C1005X5R0J104K050BA; Capacitance: 0.1µF; Applications: General Purpose; Category: Capacitors; ComponentLink1Description: http://www.kemet.com/datasheets&C0402C104K4RACTU; ComponentLink1URL: http://www.kemet.com/datasheets&C0402C104K4RACTU; Features: -; Height - Seated (Max): -; Lead Spacing: -; Lead Style: -; Mounting Type: Surface Mount, MLCC; Operating Temperature: -55°C ~ 85°C; Package / Case: 0402 (1005 Metric); Packaging: Digi-Reel®; Pricing 1: 1=0.1, 10=0.026, 100=0.0121, 250=0.00992, 500=0.00848, 1000=0.0066, 5000=0.0055 (USD); Ratings: -; RoHS: RoHS Compliant; Size / Dimension: 0.039" L x 0.020" W (1.00mm x 0.50mm); Stock 1: 127604; Supplier 1: Digi-Key; Supplier Part Number 1: 445-1266-6-ND; Temperature Coefficient: X5R; Thickness (Max): 0.022" (0.55mm); Tolerance: ±10%; Voltage - Rated: 6.3V
C4 C7-C15 = CAP_10uF_Y5V_10V_10%_0805: CAP CER 10UF 10V Y5V 0805; Manufacturer: TDK Corporation; Manufacturer Part Number: C2012Y5V1A106Z; Capacitance: 10µF; Tolerance: -20%, +80%; Temperature Coefficient: Y5V (F); Supplier 1: Digi-Key; Supplier Part Number 1: 445-1371-6-ND; RoHS: RoHS Compliant; Category: Capacitors; Stock 1: 123307; Pricing 1: 1=0.15, 10=0.105, 100=0.0499, 250=0.042, 500=0.03518, 1000=0.02887 (USD); Voltage - Rated: 10V; Mounting Type: Surface Mount, MLCC; Operating Temperature: -30°C ~ 85°C; Applications: General Purpose; Ratings: -; Package / Case: 0805 (2012 Metric); Size / Dimension: 0.079" L x 0.049" W (2.00mm x 1.25mm); Height - Seated (Max): -; Thickness (Max): 0.057" (1.45mm); Lead Spacing: -; Features: -; Packaging: Digi-Reel®; Lead Style: -; ComponentLink1URL: http://media.digikey.com/pdf/Data%20Sheets/TDK%20PDFs/C_Series_GeneralAppl_B11.pdf; ComponentLink1Description: http://media.digikey.com/pdf/Data%20Sheets/TDK%20PDFs/C_Series_GeneralAppl_B11.pdf
C16-C18 = CAP_2.2uF_X5R_6.3V_10%_0402: CAP CER 2.2UF 6.3V 10% X5R 0402; Manufacturer: TDK Corporation; Manufacturer Part Number: C1005X5R0J225K050BC; Capacitance: 2.2µF; Supplier 1: Digi-Key; Supplier Part Number 1: 445-6847-6-ND; RoHS: RoHS Compliant; Category: Capacitors; Stock 1: 47221; Pricing 1: 1=0.24, 10=0.2, 100=0.1, 250=0.075, 500=0.06626, 1000=0.05875, 5000=0.04875 (USD); Voltage - Rated: 6.3V; Tolerance: ±10%; Temperature Coefficient: X5R; Mounting Type: Surface Mount, MLCC; Operating Temperature: -55°C ~ 85°C; Applications: General Purpose; Ratings: -; Package / Case: 0402 (1005 Metric); Size / Dimension: 0.039" L x 0.020" W (1.00mm x 0.50mm); Height - Seated (Max): -; Thickness (Max): 0.022" (0.55mm); Lead Spacing: -; Features: -; Packaging: Digi-Reel®; Lead Style: -; ComponentLink1URL: http://product.tdk.com/capacitor/mlcc/en/documents/mlcc_commercial_general_en.pdf; ComponentLink1Description: http://product.tdk.com/capacitor/mlcc/en/documents/mlcc_commercial_general_en.pdf
C19 = CAP_2.2uF_X5R_6.3V_10%_0402: CAP CER 470PF 50V 10% X7R 0402; Manufacturer: Murata Electronics North America; Manufacturer Part Number: GRM155R71H471KA01D; Applications: General Purpose; Capacitance: 470pF; Category: Capacitors; ComponentLink1Description: http://psearch.murata.com/capacitor/product/GRM155R71H471KA01#.pdf; ComponentLink1URL: http://psearch.murata.com/capacitor/product/GRM155R71H471KA01#.pdf; Features: -; Height - Seated (Max): -; Lead Spacing: -; Lead Style: -; Mounting Type: Surface Mount, MLCC; Operating Temperature: -55°C ~ 125°C; Package / Case: 0402 (1005 Metric); Packaging: Digi-Reel®; Pricing 1: 1=0.1, 10=0.025, 50=0.0136, 100=0.0116, 250=0.00944, 500=0.00808, 1000=0.0063, 5000=0.00525 (USD); Ratings: -; RoHS: RoHS Compliant; Size / Dimension: 0.039" L x 0.020" W (1.00mm x 0.50mm); Stock 1: 211618; Supplier 1: Digi-Key; Supplier Part Number 1: 490-1300-6-ND; Temperature Coefficient: X7R; Thickness (Max): 0.022" (0.55mm); Tolerance: ±10%; Voltage - Rated: 50V
C20 = CAP_0.1uF_X7R_16V_10% 0402: CAP CER 0.1UF 6.3V 10% X5R 0402; Manufacturer: TDK Corporation; Manufacturer Part Number: C1005X5R0J104K050BA; Capacitance: 0.1µF; Applications: General Purpose; Category: Capacitors; ComponentLink1Description: http://www.kemet.com/datasheets&C0402C104K4RACTU; ComponentLink1URL: http://www.kemet.com/datasheets&C0402C104K4RACTU; Features: -; Height - Seated (Max): -; Lead Spacing: -; Lead Style: -; Mounting Type: Surface Mount, MLCC; Operating Temperature: -55°C ~ 85°C; Package / Case: 0402 (1005 Metric); Packaging: Digi-Reel®; Pricing 1: 1=0.1, 10=0.026, 100=0.0121, 250=0.00992, 500=0.00848, 1000=0.0066, 5000=0.0055 (USD); Ratings: -; RoHS: RoHS Compliant; Size / Dimension: 0.039" L x 0.020" W (1.00mm x 0.50mm); Stock 1: 127604; Supplier 1: Digi-Key; Supplier Part Number 1: 445-1266-6-ND; Temperature Coefficient: X5R; Thickness (Max): 0.022" (0.55mm); Tolerance: ±10%; Voltage - Rated: 6.3V
D1 = LED_LTST-C150GKT: LED GREEN CLEAR 0805 SMD; Manufacturer: Lite-On Inc; Manufacturer Part Number: LTST-C170KGKT; CLASS: DISCRETE; TN: 257-0020-000; Millicandela Rating: 35mcd; Voltage - Forward (Vf) Typ: 2V; Current - Test: 20mA; Wavelength - Dominant: 571nm; Wavelength - Peak: 574nm; Viewing Angle: 130°; Lens Style/Size: Rectangle with Flat Top, 1.4mm x 1.25mm; Supplier 1: Digi-Key; Supplier Part Number 1: 160-1414-6-ND; RoHS: RoHS Compliant; Category: Optoelectronics; Stock 1: 274890; Pricing 1: 1=0.37, 10=0.267, 100=0.1574, 250=0.11136, 500=0.09504, 1000=0.07425 (USD); Color: Green; Lens Type: Clear; Package / Case: 0805 (2012 Metric); Size / Dimension: 2.00mm L x 1.25mm W; Height: 1.10mm; Mounting Type: Surface Mount; Packaging: Digi-Reel®; Luminous Flux @ Current - Test: -; ComponentLink1URL: http://optoelectronics.liteon.com/en-us/api/DwonloadFileHandler.ashx?txtSpecNo=DS22-2000-073&txtPartNo=LTST-C170KGKT; ComponentLink1Description: http://optoelectronics.liteon.com/en-us/api/DwonloadFileHandler.ashx?txtSpecNo=DS22-2000-073&txtPartNo=LTST-C170KGKT
L1 = IND_2.2uH_2.6A_10%_SMD: Inductor 2.2uH smt 2.6A, 58 milliohm; Manufacturer: Murata Electronics North America; Manufacturer Part Number: LQM2HPN2R2MG0L; Inductance: 2.2µH; Current Rating: 1.3A; Tolerance: ±20%; Shielding: Shielded; DC Resistance (DCR): 100 mOhm Max; Frequency - Self Resonant: 40MHz; Frequency - Test: 1MHz; Supplier 1: Digi-Key; Supplier Part Number 1: 490-5114-6-ND; RoHS: RoHS Compliant; Category: Inductors, Coils, Chokes; Stock 1: 4689; Pricing 1: 1=0.34, 10=0.307, 25=0.2728, 50=0.2388, 100=0.2217, 250=0.2046, 500=0.19438, 750=0.17732, 1000=0.15686 (USD); Type: -; Current - Saturation: -; Material - Core: -; Q @ Freq: -; Operating Temperature: -55°C ~ 125°C; Package / Case: 1008 (2520 Metric); Size / Dimension: 0.098" L x 0.079" W x 0.035" H (2.50mm x 2.00mm x 0.90mm); Mounting Type: Surface Mount; Packaging: Digi-Reel®; ComponentLink1URL: http://search.murata.co.jp/Ceramy/image/img/PDF/ENG/L0075S0104LQM2HP_G0.pdf; ComponentLink1Description: http://search.murata.co.jp/Ceramy/image/img/PDF/ENG/L0075S0104LQM2HP_G0.pdf
L2 L3 = IND_2.2uH_2.6A_10%_SMD: INDUCTOR 2.2UH 20% 1300MA 1008; PartName: 2.2uH10%2.6Asmd; Mfr: TDK; MfrNum: VLCF5020T-2R2N2R6-3; TIIntPartnumber: 1L0025; Manufacturer: Murata Electronics North America; Manufacturer Part Number: LQM2HPN2R2MG0L; Vendor: Digikey; Cost100: 1.11; Cost10K: 0.37; Inductance: 2.2µH; Current Rating: 1.3A; Shielding: Shielded; DC Resistance (DCR): 100 mOhm Max; Frequency - Self Resonant: 40MHz; Frequency - Test: 1MHz; Supplier 1: Digi-Key; Supplier Part Number 1: 490-5114-6-ND; RoHS: RoHS Compliant; Category: Inductors, Coils, Chokes; Stock 1: 4689; Pricing 1: 1=0.34, 10=0.307, 25=0.2728, 50=0.2388, 100=0.2217, 250=0.2046, 500=0.19438, 750=0.17732, 1000=0.15686 (USD); Type: -; Current - Saturation: -; Tolerance: ±20%; Material - Core: -; Q @ Freq: -; Operating Temperature: -55°C ~ 125°C; Package / Case: 1008 (2520 Metric); Size / Dimension: 0.098" L x 0.079" W x 0.035" H (2.50mm x 2.00mm x 0.90mm); Mounting Type: Surface Mount; Packaging: Digi-Reel®; ComponentLink1URL: http://www.tdk.co.jp/tefe02/e531_vlcf.pdf; ComponentLink1Description: http://www.tdk.co.jp/tefe02/e531_vlcf.pdf
P1 = Power_Jack: CONN PWR JACK 2.1X5.5MM HIGH CUR; Manufacturer: CUI Inc; Manufacturer Part Number: PJ-002AH; Gender: Male; Plug/Mating Plug Diameter: 2.1mm ID, 5.5mm OD; Number of Positions/Contacts: 2 Conductors, 3 Contacts; Internal Switch(s): Single Switch, Normally Closed; Shielding: Unshielded; Current Rating: 5A; Supplier 1: Digi-Key; Supplier Part Number 1: CP-002AH-ND; RoHS: RoHS Compliant; Category: Connectors, Interconnects; Stock 1: 81962; Pricing 1: 1=1.01, 10=0.704, 100=0.4724, 500=0.3819, 1000=0.3417, 2500=0.27135 (USD); Connector Type: Jack; Mounting Type: Through Hole, Right Angle; Termination: Solder Eyelet(s); Features: -; Color: Black; Contact Material: Copper Alloy; Contact Material - Plating: Nickel; Housing Color: Black; Housing Material: Thermoplastic; Operating Temperature: -25°C ~ 85°C; ComponentLink1URL: http://www.cui.com/Product/Resource/DigiKeyPDF/PJ-002AH.pdf; ComponentLink1Description: http://www.cui.com/Product/Resource/DigiKeyPDF/PJ-002AH.pdf
R1 = RES_100K_1/16W_1%_0402: RES 100K OHM 1/16W 1% 0402 SMD; Manufacturer: Stackpole Electronics Inc; Manufacturer Part Number: RMCF0402FT100K; Power (Watts): 0.063W, 1/16W; Temperature Coefficient: ±100ppm/°C; Category: Resistors; ComponentLink1Description: http://www.seielect.com/Catalog/SEI-RMCF_RMCP.pdf; ComponentLink1URL: http://www.seielect.com/Catalog/SEI-RMCF_RMCP.pdf; Composition: Thick Film; Features: -; Height: 0.016" (0.40mm); Number of Terminations: 2; Package / Case: 0402 (1005 Metric); Packaging: Digi-Reel®; Pricing 1: 1=0.04, 10=0.025, 50=0.0138, 100=0.0105, 250=0.0078, 500=0.00576, 1000=0.00384, 2500=0.00324, 5000=0.0027 (USD); Resistance (Ohms): 100k; RoHS: RoHS Compliant; Size / Dimension: 0.039" L x 0.020" W (1.00mm x 0.50mm); Stock 1: 851196; Supplier 1: Digi-Key; Supplier Device Package: 0402; Supplier Part Number 1: RMCF0402FT100KDKR-ND; Tolerance: ±1%
R3 R4 = RES_1.5K_1/16W_5%_0402: RES 1.50K OHM 1/16W 1% 0402 SMD; Manufacturer: Yageo; Manufacturer Part Number: RC0402FR-071K5L; Power (Watts): 0.063W, 1/16W; Temperature Coefficient: ±100ppm/°C; Supplier 1: Digi-Key; Supplier Part Number 1: 311-1.50KLRDKR-ND; RoHS: RoHS Compliant; Category: Resistors; Stock 1: 465266; Pricing 1: 1=0.1, 10=0.014, 25=0.0104, 100=0.0063, 250=0.0054, 500=0.00382, 1000=0.0027, 2500=0.00234, 5000=0.00203 (USD); Resistance (Ohms): 1.5k; Composition: Thick Film; Features: -; Tolerance: ±1%; Package / Case: 0402 (1005 Metric); Supplier Device Package: 0402; Size / Dimension: 0.039" L x 0.020" W (1.00mm x 0.50mm); Height: 0.016" (0.40mm); Number of Terminations: 2; Packaging: Digi-Reel®; ComponentLink1URL: http://www.yageo.com/documents/recent/PYu-RC0402_51_RoHS_L_6.pdf; ComponentLink1Description: http://www.yageo.com/documents/recent/PYu-RC0402_51_RoHS_L_6.pdf
R5-R9 = RES_0_1/16W_1%_0402: RES 0.0 OHM 1/16W 0402 SMD; Manufacturer: Yageo; Manufacturer Part Number: RC0402JR-070RL; Power (Watts): 0.063W, 1/16W; Resistance (Ohms): 0.0; Tolerance: Jumper; Category: Resistors; ComponentLink1Description: http://www.yageo.com/documents/recent/PYu-RC0402_51_RoHS_L_6.pdf; ComponentLink1URL: http://www.yageo.com/documents/recent/PYu-RC0402_51_RoHS_L_6.pdf; Composition: Thick Film; Features: -; Height: 0.016" (0.40mm); Number of Terminations: 2; Package / Case: 0402 (1005 Metric); Packaging: Digi-Reel®; Pricing 1: 1=0.1, 10=0.012, 25=0.0092, 100=0.0055, 250=0.00476, 500=0.00336, 1000=0.00237, 2500=0.00206, 5000=0.00178 (USD); RoHS: RoHS Compliant; Size / Dimension: 0.039" L x 0.020" W (1.00mm x 0.50mm); Stock 1: 4904429; Supplier 1: Digi-Key; Supplier Device Package: 0402; Supplier Part Number 1: 311-0.0JRDKR-ND; Temperature Coefficient: -
R10 = RES_470_1/10W_5%_0402: RES 470K OHM 1/16W 1% 0402 SMD; Manufacturer: Yageo; Manufacturer Part Number: RC0402FR-07470KL; Power (Watts): 0.063W, 1/16W; Temperature Coefficient: ±100ppm/°C; Supplier 1: Digi-Key; Supplier Part Number 1: 311-470KLRDKR-ND; RoHS: RoHS Compliant; Category: Resistors; Stock 1: 133693; Pricing 1: 1=0.1, 10=0.014, 25=0.0104, 100=0.0063, 250=0.0054, 500=0.00382, 1000=0.0027, 2500=0.00234, 5000=0.00203 (USD); Resistance (Ohms): 470k; Composition: Thick Film; Features: -; Tolerance: ±1%; Package / Case: 0402 (1005 Metric); Supplier Device Package: 0402; Size / Dimension: 0.039" L x 0.020" W (1.00mm x 0.50mm); Height: 0.016" (0.40mm); Number of Terminations: 2; Packaging: Digi-Reel®; ComponentLink1URL: http://www.yageo.com/documents/recent/PYu-RC0402_51_RoHS_L_6.pdf; ComponentLink1Description: http://www.yageo.com/documents/recent/PYu-RC0402_51_RoHS_L_6.pdf
R11 = RES_470_1/10W_5%_0402: RES 280K OHM 1/16W 1% 0402 SMD; Manufacturer: Stackpole Electronics Inc; Manufacturer Part Number: RMCF0402FT280K; Power (Watts): 0.063W, 1/16W; Temperature Coefficient: ±100ppm/°C; Supplier 1: Digi-Key; Supplier Part Number 1: RMCF0402FT280KDKR-ND; RoHS: RoHS Compliant; Category: Resistors; Stock 1: 31693; Pricing 1: 1=0.04, 10=0.025, 50=0.0138, 100=0.0105, 250=0.0078, 500=0.00576, 1000=0.00384, 2500=0.00324, 5000=0.0027 (USD); Resistance (Ohms): 280k; Composition: Thick Film; Features: -; Tolerance: ±1%; Package / Case: 0402 (1005 Metric); Supplier Device Package: 0402; Size / Dimension: 0.039" L x 0.020" W (1.00mm x 0.50mm); Height: 0.016" (0.40mm); Number of Terminations: 2; Packaging: Digi-Reel®; ComponentLink1URL: http://www.seielect.com/Catalog/SEI-RMCF_RMCP.pdf; ComponentLink1Description: http://www.seielect.com/Catalog/SEI-RMCF_RMCP.pdf
R12 = RES_470_1/10W_5%_0402: RES 820 OHM 1/10W 5% 0402 SMD; Manufacturer: Yageo; Manufacturer Part Number: RC0402JR-07820RL; Description: RES 820 OHM 1/16W 5% 0402 SMD; Resistance (Ohms): 820; Power (Watts): 0.063W, 1/16W; Temperature Coefficient: ±100ppm/°C; Supplier 1: Digi-Key; Supplier Part Number 1: 311-820JRDKR-ND; RoHS: RoHS Compliant; Category: Resistors; Stock 1: 7437; Pricing 1: 1=0.1, 10=0.012, 25=0.0092, 100=0.0055, 250=0.00476, 500=0.00336, 1000=0.00237, 2500=0.00206, 5000=0.00178 (USD); Composition: Thick Film; Features: -; Tolerance: ±5%; Package / Case: 0402 (1005 Metric); Supplier Device Package: 0402; Size / Dimension: 0.039" L x 0.020" W (1.00mm x 0.50mm); Height: 0.016" (0.40mm); Number of Terminations: 2; Packaging: Digi-Reel®; ComponentLink1URL: http://www.yageo.com/documents/recent/PYu-RC0402_51_RoHS_L_6.pdf; ComponentLink1Description: http://www.yageo.com/documents/recent/PYu-RC0402_51_RoHS_L_6.pdf
U2 = PWR_TPS65217_2: IC PMIC BATT PWR SYST 48VQFN; Manufacturer: Texas Instruments; Manufacturer Part Number: TPS65217CRSLR; Voltage - Supply: 2.75 V ~ 5.8 V; Supplier 1: Digi-Key; Supplier Part Number 1: 296-34814-6-ND; RoHS: RoHS Compliant; Category: Integrated Circuits (ICs); Stock 1: 0; Pricing 1: 1=8.01, 10=7.204, 25=6.5516, 100=4.1918, 250=4.11412, 500=4.0365, 750=3.95888 (USD); Applications: Battery Management, Display (LED Drivers), Handheld/Mobile Devices, Power Supply; Current - Supply: -; Operating Temperature: -40°C ~ 105°C; Mounting Type: Surface Mount; Package / Case: 48-VFQFN Exposed Pad; Supplier Device Package: 48-VQFN-EP (6x6); Packaging: Digi-Reel®; ComponentLink1URL: http://www.ti.com/lit/ds/symlink/tps65217c.pdf; ComponentLink1Description: http://www.ti.com/lit/ds/symlink/tps65217c.pdf
U4 = TL5209: IC LDO VOLT REG 500MA 8-SOIC; Manufacturer: Texas Instruments; Manufacturer Part Number: TL5209DR; Regulator Topology: Positive Adjustable; Voltage - Output: 2.5 V ~ 6.5 V; Voltage - Input: 2.5 V ~ 16 V; Voltage - Dropout (Typical): 0.35V @ 500mA; Number of Regulators: 1; Current - Output: 500mA (Max); Supplier 1: Digi-Key; Supplier Part Number 1: 296-21569-6-ND; RoHS: RoHS Compliant; Category: Integrated Circuits (ICs); Stock 1: 7190; Pricing 1: 1=1.41, 10=1.244, 25=1.1232, 100=0.9828, 250=0.86192, 500=0.7644, 1000=0.6045 (USD); Current - Limit (Min): -; Operating Temperature: -40°C ~ 125°C; Mounting Type: Surface Mount; Package / Case: 8-SOIC (0.154", 3.90mm Width); Supplier Device Package: 8-SOIC; Packaging: Digi-Reel®; ComponentLink1URL: http://media.digikey.com/pdf/Data%20Sheets/Texas%20Instruments%20PDFs/TL5209.pdf; ComponentLink1Description: http://media.digikey.com/pdf/Data%20Sheets/Texas%20Instruments%20PDFs/TL5209.pdf